# EAGLE schematic M139A (EAGLE 6.6.0)
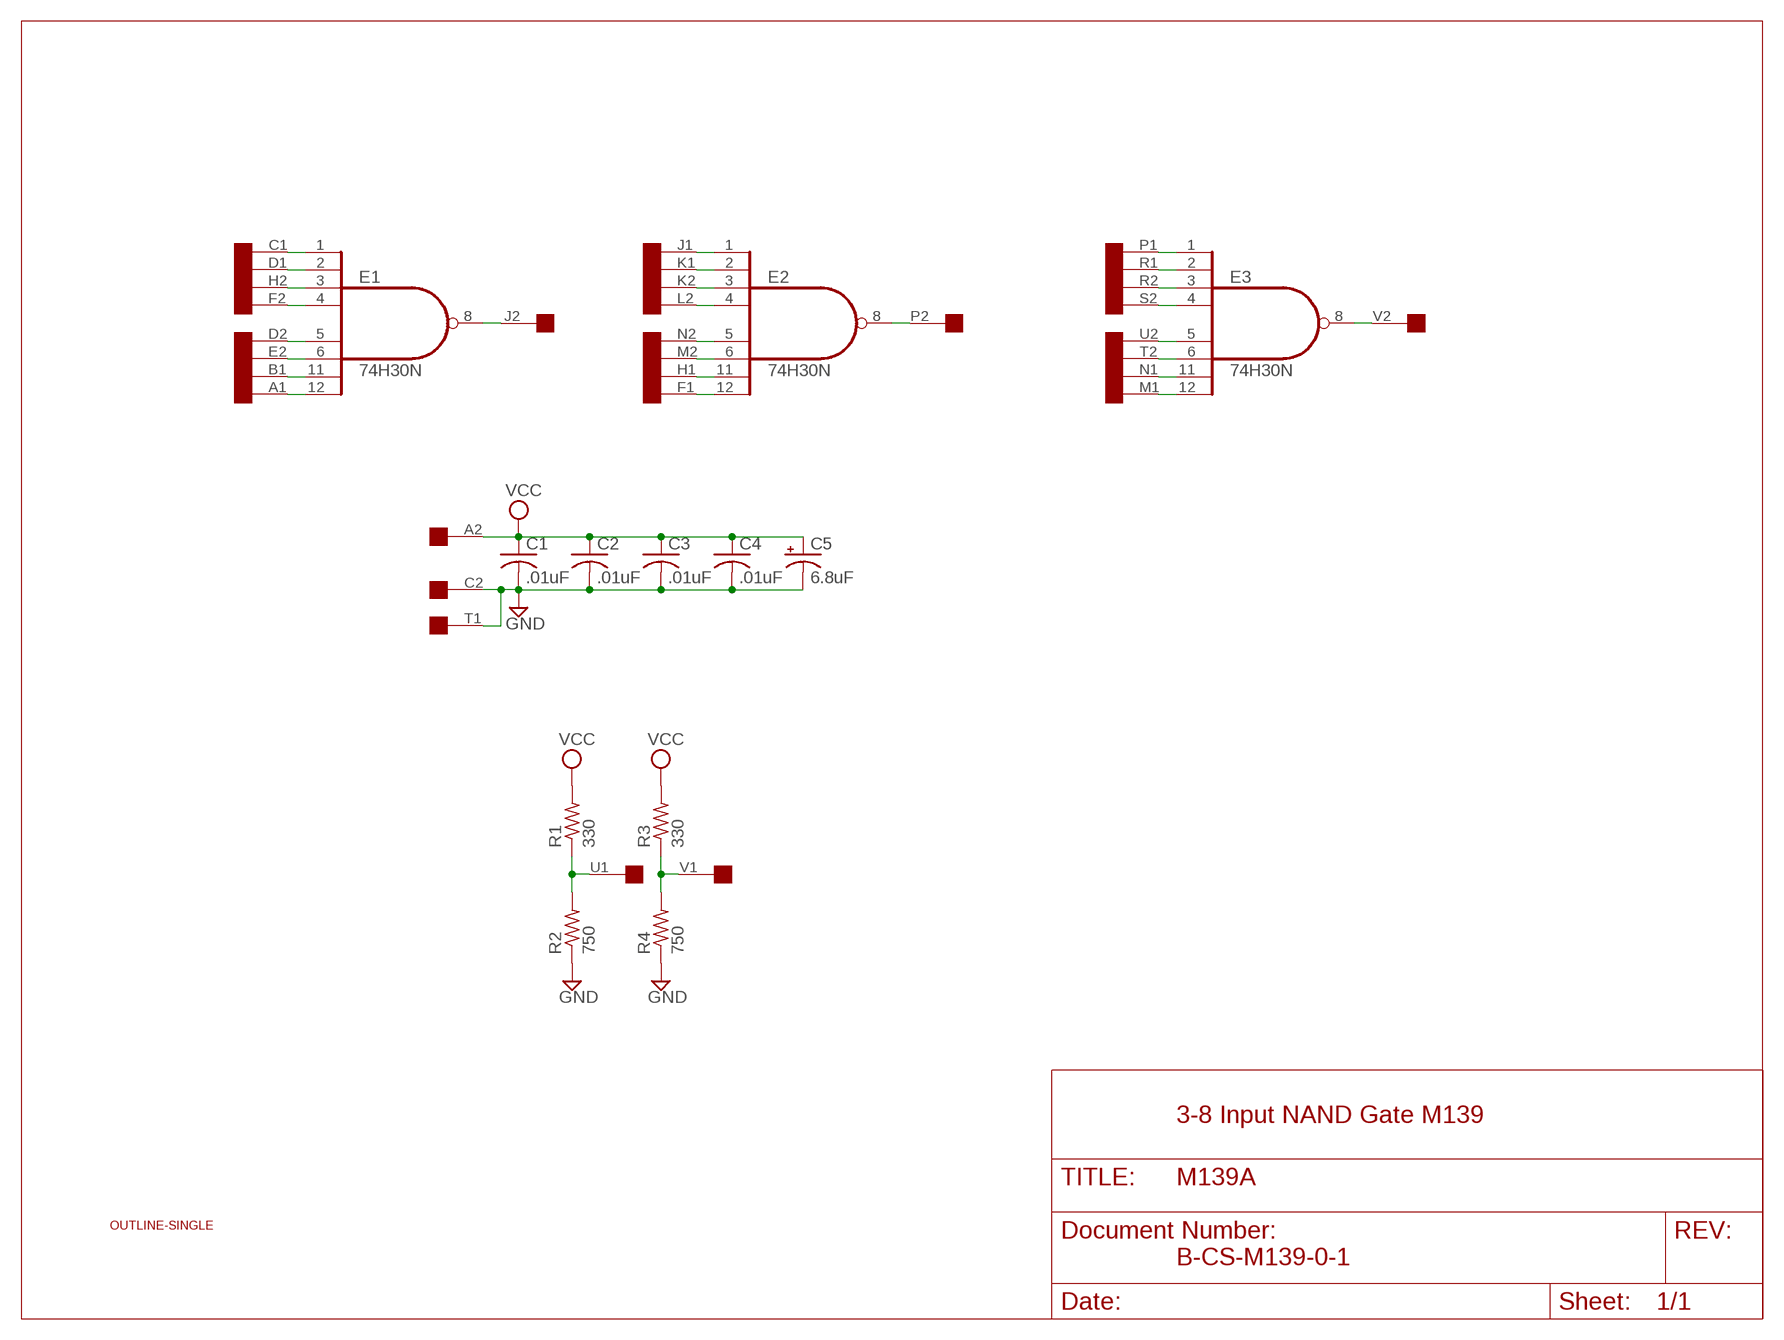
[diagram p0: schematic, sheet 1]

## Parts
C1  .01uF  C-US050-025X075  [C050-025X075]
C2  .01uF  C-US050-025X075  [C050-025X075]
C3  .01uF  C-US050-025X075  [C050-025X075]
C4  .01uF  C-US050-025X075  [C050-025X075]
C5  6.8uF  CPOL-USE20-8AXIAL  [E12-8]
E1  74H30N  74S30N  [DIL14]
E2  74H30N  74S30N  [DIL14]
E3  74H30N  74S30N  [DIL14]
R1  330  R-US_0207/10  [0207/10]
R2  750  R-US_0207/10  [0207/10]
R3  330  R-US_0207/10  [0207/10]
R4  750  R-US_0207/10  [0207/10]
U$1  OUTLINE-SINGLE  [SINGLE]
U$2  SINGLE  [EDGE-CON2]

## Nets
GND: C1.2 C2.2 C3.2 C4.2 C5.- R2.1 R4.1 U$2.C2 U$2.T1
N$1: E1.1(I0) U$2.C1
N$2: E1.2(I1) U$2.D1
N$3: E1.3(I2) U$2.H2
N$4: E1.4(I3) U$2.F2
N$5: E1.6(I5) U$2.E2
N$6: E1.5(I4) U$2.D2
N$7: E1.11(I6) U$2.B1
N$8: E1.12(I7) U$2.A1
N$9: E1.8(O) U$2.J2
N$10: E2.1(I0) U$2.J1
N$11: E2.2(I1) U$2.K1
N$12: E2.3(I2) U$2.K2
N$13: E2.4(I3) U$2.L2
N$14: E2.5(I4) U$2.N2
N$15: E2.6(I5) U$2.M2
N$16: E2.8(O) U$2.P2
N$17: E2.11(I6) U$2.H1
N$18: E2.12(I7) U$2.F1
N$19: E3.8(O) U$2.V2
N$20: E3.1(I0) U$2.P1
N$21: E3.2(I1) U$2.R1
N$22: E3.3(I2) U$2.R2
N$23: E3.4(I3) U$2.S2
N$24: E3.5(I4) U$2.U2
N$25: E3.6(I5) U$2.T2
N$26: E3.12(I7) U$2.M1
N$27: E3.11(I6) U$2.N1
N$30: R1.1 R2.2 U$2.U1
N$31: R3.1 R4.2 U$2.V1
VCC: C1.1 C2.1 C3.1 C4.1 C5.+ R1.2 R3.2 U$2.A2
Unconnected: E1.9 E1.10 E1.13 E2.9 E2.10 E2.13 E3.9 E3.10 E3.13 U$2.B2 U$2.E1 U$2.L1 U$2.S1

## Notes on the sheet
- 3-8 Input NAND Gate M139
- B-CS-M139-0-1

## Power pins joined to a net without a drawn wire
GND: E1.7(GND) E2.7(GND) E3.7(GND)
VCC: E1.14(VCC) E2.14(VCC) E3.14(VCC)

## Library data of the parts
C1-C4 = rcl:C-US: CAPACITOR, American symbol
C5 = dec-con:CPOL-USE20-8AXIAL: A 0.8 inch electrolytic.
E1-E3 = dec-con:74*30: 8-input NAND gate
R1-R4 = rcl:R-US_: RESISTOR, American symbol
U$1 = dec-con:OUTLINE-*: Board outlines for DEC boards.
U$2 = dec-con:SINGLE: Single-Height DEC board

## Net classes
0 default: width 0.813 mm